# EAGLE design LEDChaserSchematic (EAGLE 9.6.2)
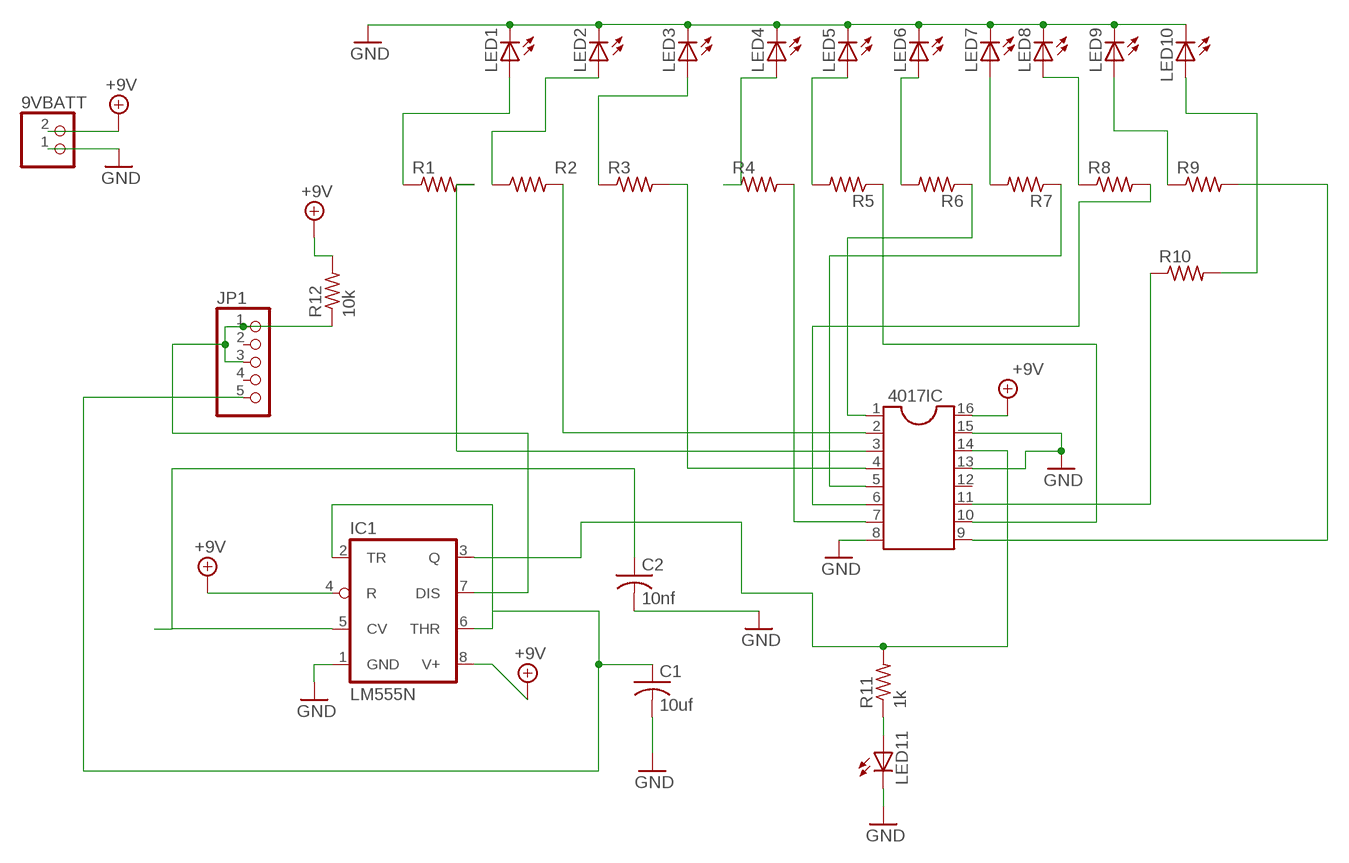
[diagram p0: schematic, sheet 1]

## Parts
9VBATT  JST_2PIN-THM  [JST-PH-2-THM]
4017IC  DIL16  [DIL16]
C1  10uf  C-US025-030X050  [C025-030X050]
C2  10nf  C-US025-030X050  [C025-030X050]
IC1  LM555N  [DIL08-ROUND]
JP1  PINHD-1X5  [1X05]
LED1  LED5MM  [LED5MM]
LED2  LED5MM  [LED5MM]
LED3  LED5MM  [LED5MM]
LED4  LED5MM  [LED5MM]
LED5  LED5MM  [LED5MM]
LED6  LED5MM  [LED5MM]
LED7  LED5MM  [LED5MM]
LED8  LED5MM  [LED5MM]
LED9  LED5MM  [LED5MM]
LED10  LED5MM  [LED5MM]
LED11  LED5MM  [LED5MM]
R1  R-US_0204/5  [0204/5]
R2  R-US_0204/5  [0204/5]
R3  R-US_0204/5  [0204/5]
R4  R-US_0204/5  [0204/5]
R5  R-US_0204/5  [0204/5]
R6  R-US_0204/5  [0204/5]
R7  R-US_0204/5  [0204/5]
R8  R-US_0204/5  [0204/5]
R9  R-US_0204/5  [0204/5]
R10  R-US_0204/5  [0204/5]
R11  1k  R-US_0204/5  [0204/5]
R12  10k  R-US_0204/5  [0204/5]

## Nets
+9V: 9VBATT.2 4017IC.16 IC1.4(R) IC1.8(V+) R12.2
GND: 9VBATT.1 4017IC.8 4017IC.13 4017IC.15 C1.2 C2.2 IC1.1(GND) LED1.K(C) LED2.K(C) LED3.K(C) LED4.K(C) LED5.K(C) LED6.K(C) LED7.K(C) LED8.K(C) LED9.K(C) LED10.K(C) LED11.K(C)
N$1: LED1.A R1.1
N$2: LED2.A R2.1
N$3: LED3.A R3.1
N$4: LED4.A R4.1
N$5: LED5.A R5.2
N$6: LED6.A R6.2
N$7: LED7.A R7.2
N$8: LED8.A R8.1
N$9: LED9.A R9.1
N$10: LED10.A R10.2
N$11: 4017IC.3 R1.2
N$12: 4017IC.2 R2.2
N$13: 4017IC.4 R3.2
N$14: 4017IC.7 R4.2
N$15: 4017IC.10 R5.1
N$16: 4017IC.1 R6.1
N$17: 4017IC.5 R7.1
N$18: 4017IC.6 R8.2
N$19: 4017IC.9 R9.2
N$20: 4017IC.11 R10.1
N$21: C1.1 IC1.2(TR) IC1.6(THR) JP1.5
N$22: C2.1 IC1.5(CV)
N$23: 4017IC.14 IC1.3(Q) R11.2
N$24: LED11.A R11.1
N$25: IC1.7(DIS) JP1.1 JP1.3 R12.1
Unconnected: 4017IC.12 JP1.2 JP1.4

## Library data of the parts
9VBATT = adafruit:JST_2PIN: JST 2-Pin Connectors of various flavors SMT-RA (S2B-PH-SM4) 4UConnector #17311 SMT (B2B-PH-SM4) THM-RA (S2B-PH) THM (B2B-PH)
4017IC = ic-package:DIL16: Dual In Line / Socket
C1 C2 = adafruit:C-US: CAPACITOR, American symbol
IC1 = adafruit:*555: TIMER Changed DIP package to have round (not oval) pin pads http://www.ladyada.net/library/pcb/eaglelibrary.html
JP1 = pinhead:PINHD-1X5: PIN HEADER
LED1-LED11 = adafruit:LED: LED OSRAM: - CHIPLED LG R971, LG N971, LY N971, LG Q971, LY Q971, LO R971, LY R971 LH N974, LH R974 LS Q976, LO Q976, LY Q976 LO Q996 - Hyper CHIPLED LW Q18S LB Q993, LB Q99A, LB R99A - SideLED LS A670, LO A670, LY A670, LG A670, LP A670 LB A673, LV A673, LT A673, LW A673 LH A674 LY A675 LS A676, LA A676, LO A676, LY A676, LW A676 LS A679, LY A679, LG A679 - Hyper Micro SIDELED® LS Y876, LA Y876, LO Y876, LY Y876 LT Y87S - SmartLED LW L88C, LW L88S LB L89C, LB L89S, LG L890 LS L89K, LO L89K, LY L89K LS L896, LA L896, LO L896, LY L896 - TOPLED LS T670, LO T670, LY T670, LG T670, LP T670 LSG T670, LSP T670, LSY T670, LOP T670, LYG T670 LG T671, LOG T671, LSG T671 LB T673, LV T673, LT T673, LW T673 LH T674 LS T676, LA T676, LO T676, LY T676, LB T676, LH T676, LSB T676, LW T676 LB T67C, LV T67C, LT T67C, LS T67K, LO T67K, LY T67K, LW E67C LS E67B, LA E67B, LO E67B, LY E67B, LB E67C, LV E67C, LT E67C LW T67C LS T679, LY T679, LG T679 LS T770, LO T770, LY T770, LG T770, LP T770 LB T773, LV T773, LT T773, LW T773 LH T774 LS E675, LA E675, LY E675, LS T675 LS T776, LA T776, LO T776, LY T776, LB T776 LHGB T686 LT T68C, LB T68C - Hyper Mini TOPLED® LB M676 - Mini TOPLED Santana® LG M470 LS M47K, LO M47K, LY M47K Source: http://www.osram.convergy.de/
R1-R12 = adafruit:R-US_: RESISTOR, American symbol

## Net classes
0 default: clearance 0.205 mm

## Board
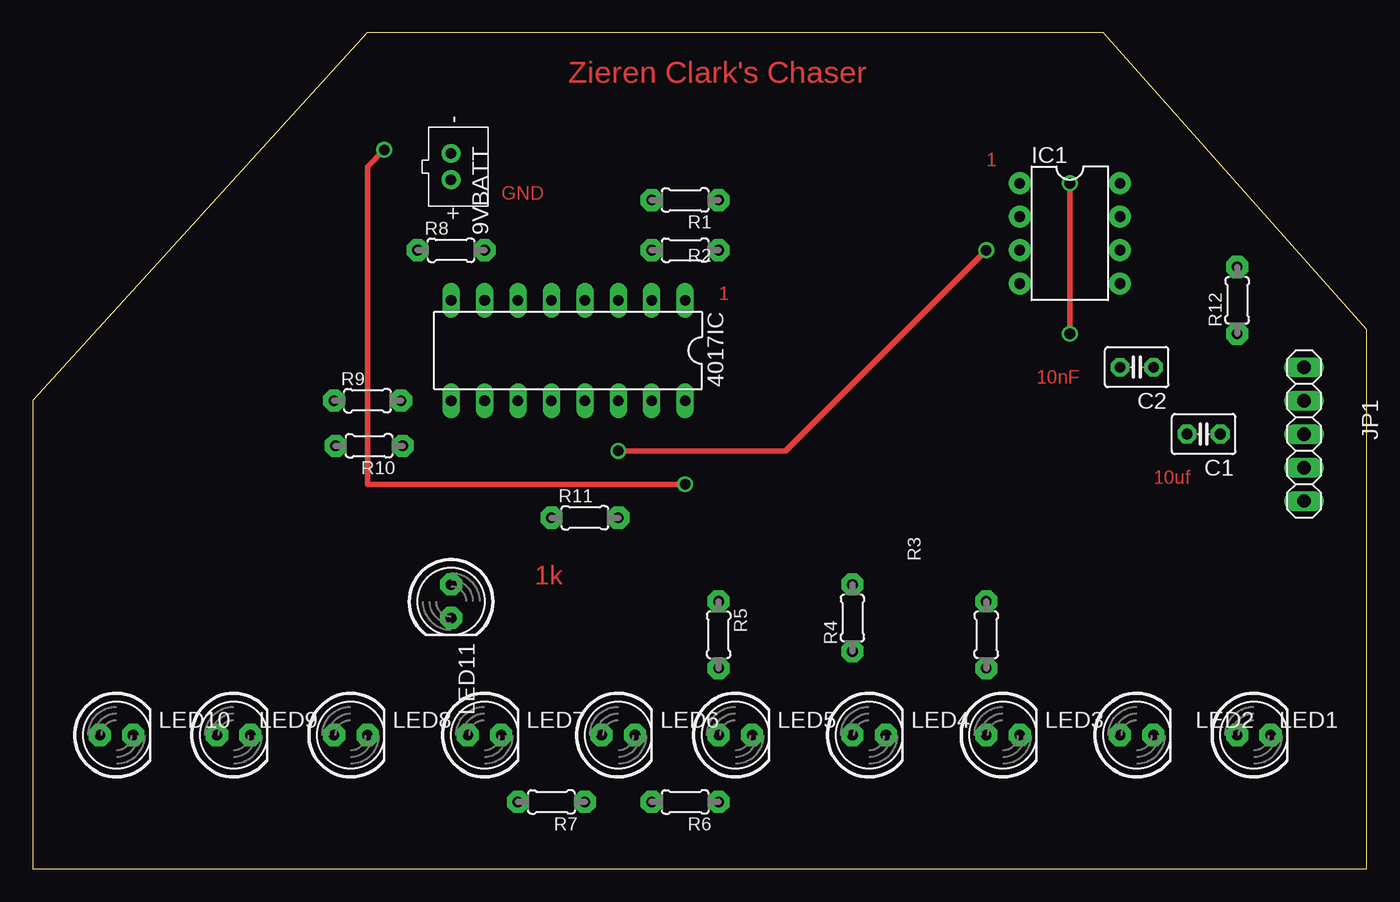
[diagram p1: board, top side]
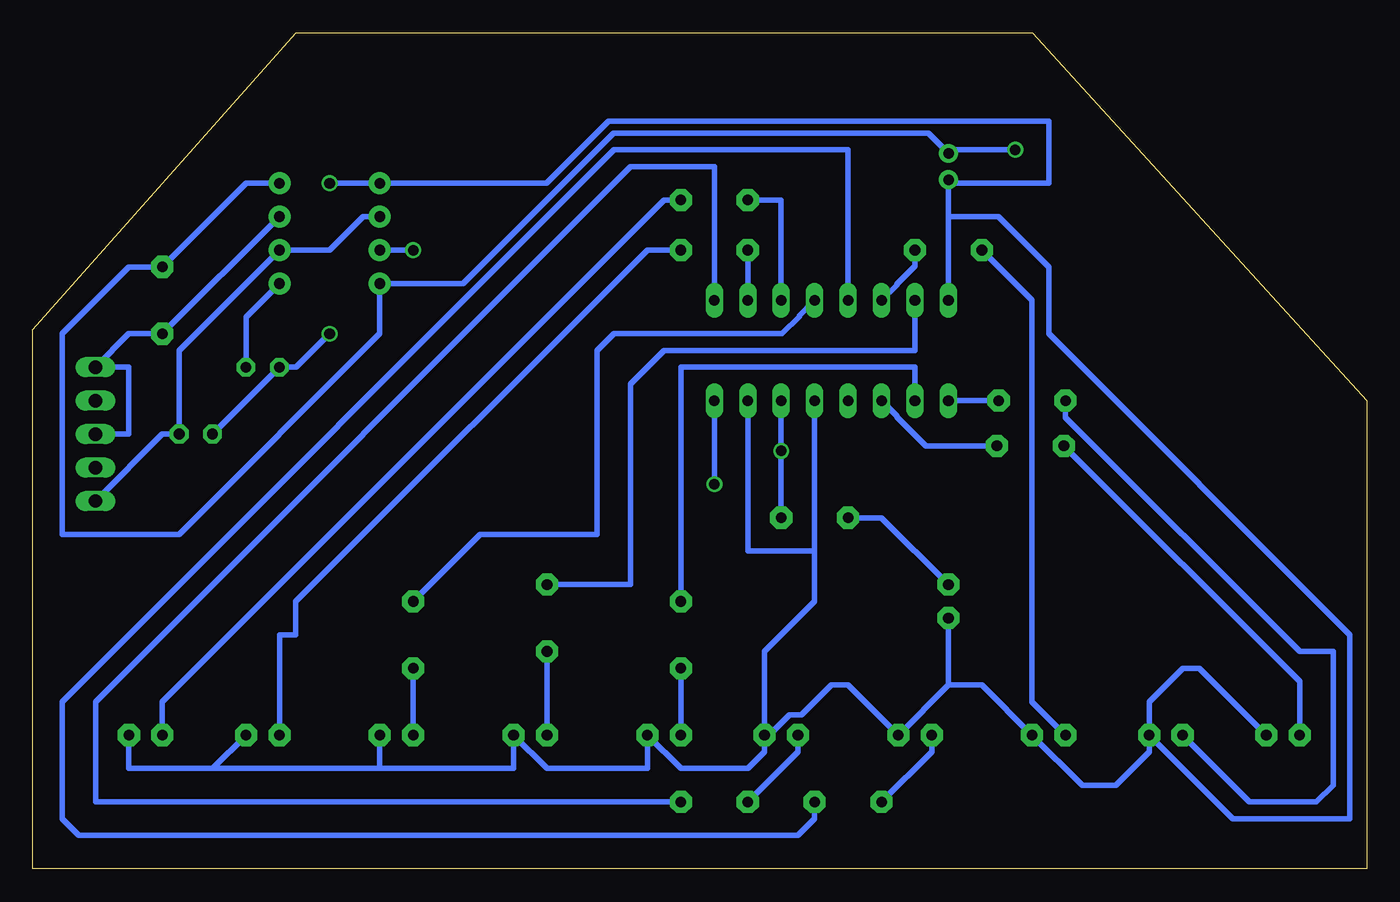
[diagram p2: board, bottom side, seen from below]

Size 101.27 x 63.49 mm. Coordinates in mm from the lower left corner, seen from the top.
Outline: 0,0 101.27,0 101.27,40.97 81.29,63.49 25.39,63.49 0,35.56 0,0
Copper layers (1*16): Top 0.035mm / dielectric 1.5mm / Bottom 0.035mm
Design rules "default *": minimum track width 16mil, minimum drill 0.35mm, track to track 20mil, track to pad 20mil, pad to pad 6mil, via to via 6mil, smd to smd 6mil, copper to edge 40mil, drill to drill 6mil, minimum pad ring 10mil, minimum via ring 8mil, stop-mask expansion 4mil, vias tented up to drill 0mil, thermal gap 10mil

### Footprints (pad centres in the part's own frame; a part is rotated, then mirrored left to right if it is on the bottom)
JST-PH-2-THM = drill 0.8 pad 1.422: 1 1,0; 2 -1,0
DIL16 = drill 0.813 long: 1 -8.89,-3.81; 2 -6.35,-3.81; 3 -3.81,-3.81; 4 -1.27,-3.81; 5 1.27,-3.81; 6 3.81,-3.81; 7 6.35,-3.81; 8 8.89,-3.81; 9 8.89,3.81; 10 6.35,3.81; 11 3.81,3.81; 12 1.27,3.81; 13 -1.27,3.81; 14 -3.81,3.81; 15 -6.35,3.81; 16 -8.89,3.81
C025-030X050 = drill 0.813 pad 1.422 octagon: 1 -1.27,0; 2 1.27,0
DIL08-ROUND = drill 0.813 pad 1.676: 1 -3.81,-3.81; 2 -1.27,-3.81; 3 1.27,-3.81; 4 3.81,-3.81; 5 3.81,3.81; 6 1.27,3.81; 7 -1.27,3.81; 8 -3.81,3.81
1X05 = drill 1.016 long: 1 -5.08,0; 2 -2.54,0; 3 0,0; 4 2.54,0; 5 5.08,0
LED5MM = drill 0.813 pad 1.676 octagon: A -1.27,0; K 1.27,0
0204/5 = drill 0.813 pad 1.676 octagon: 1 -2.54,0; 2 2.54,0

### Placement (x,y rotation side)
9VBATT  31.75,53.34 270 top
4017IC  40.64,39.37 180 top
C1  88.9,33.02 180 top
C2  83.82,38.1 180 top
IC1  78.74,48.26 270 top
JP1  96.52,33.02 270 top
LED1  92.71,10.16 0 top
LED2  83.82,10.16 0 top
LED3  73.66,10.16 0 top
LED4  63.5,10.16 0 top
LED5  53.34,10.16 0 top
LED6  44.45,10.16 0 top
LED7  34.29,10.16 0 top
LED8  24.13,10.16 0 top
LED9  15.24,10.16 0 top
LED10  6.35,10.16 0 top
LED11  31.75,20.32 270 top
R1  49.53,50.8 180 top
R2  49.53,46.99 180 top
R3  72.39,17.78 90 top
R4  62.23,19.05 90 top
R5  52.07,17.78 270 top
R6  49.53,5.08 180 top
R7  39.37,5.08 180 top
R8  31.75,46.99 0 top
R9  25.4,35.56 0 top
R10  25.53,32.13 180 top
R11  41.91,26.67 0 top
R12  91.44,43.18 90 top

### Tracks (layer width: path | path; a pad name or v marks a point on that pad's centre or on a via)
+9V  (via drill 0.8)
  Top 0.406: v49.53,29.21 25.4,29.21 25.4,53.34 v26.67,54.61
  Bottom 0.406: 4017IC.16 v49.53,29.21 | IC1.8 85.09,52.07 R12.2 93.98,45.72 99.06,40.64 99.06,25.4 90.17,25.4 74.93,40.64 IC1.4 68.6,44.45 57.17,55.88 33.29,55.88 9VBATT.2 31.48,54.61 v26.67,54.61
GND  (via drill 0.8)
  Top 0.406: v78.74,52.07 v78.74,40.64
  Bottom 0.406: 4017IC.8 31.75,49.53 | 31.75,49.53 9VBATT.1 31.48,52.07 24.13,52.07 24.13,56.79 57.55,56.79 62.28,52.07 IC1.1 v78.74,52.07 | LED1.K 93.98,7.62 87.63,7.62 | LED2.K 87.63,7.62 | 74.93,7.62 87.63,7.62 | LED3.K 74.93,7.62 | 74.93,7.62 64.77,7.62 LED4.K 62.23,7.62 54.61,7.62 LED5.K 52.07,7.62 46.99,7.62 45.72,8.89 LED6.K | LED6.K 45.37,10.16 43.82,11.71 42.9,11.71 40.64,13.97 39.37,13.97 LED7.K 31.75,13.97 | 31.75,13.97 29.21,13.97 LED8.K 21.59,6.35 19.05,6.35 16.51,8.89 LED9.K | LED10.K 12.7,15.24 13.97,15.24 16.51,12.7 LED9.K | LED9.K 10.16,3.81 1.27,3.81 1.27,17.78 24.13,40.64 24.13,45.72 27.94,49.53 31.75,49.53 | 4017IC.13 41.91,24.13 | 41.91,24.13 46.99,24.13 4017IC.15 | 41.91,24.13 41.91,20.32 45.72,16.51 LED6.K | LED11.K 31.75,13.97 | C1.2 C2.2 81.28,38.1 v78.74,40.64
N$1
  Bottom 0.406: R1.1 53.34,50.8 91.44,12.7 LED1.A
N$2
  Bottom 0.406: LED2.A 82.55,17.78 81.3,17.78 81.3,20.3 54.61,46.99 R2.1
N$3
  Bottom 0.406: R3.1 LED3.A
N$4
  Bottom 0.406: R4.1 LED4.A
N$5
  Bottom 0.406: R5.2 LED5.A
N$6
  Bottom 0.406: R6.2 43.18,8.89 LED6.A
N$7
  Bottom 0.406: LED7.A 33.02,8.89 R7.2
N$8
  Bottom 0.406: R8.1 25.4,43.18 25.4,12.7 LED8.A
N$9
  Bottom 0.406: LED9.A 8.89,5.08 3.81,5.08 2.54,6.35 2.54,16.51 5.08,16.51 22.86,34.29 R9.1
N$10
  Bottom 0.406: R10.2 5.08,14.22 LED10.A
N$11
  Bottom 0.406: 4017IC.3 44.45,50.8 R1.2
N$12
  Bottom 0.406: 4017IC.2 R2.2
N$13
  Bottom 0.406: 4017IC.4 43.08,42.01 43.08,41.95 44.39,40.64 57.15,40.64 58.42,39.37 58.42,25.4 67.31,25.4 R3.2
N$14
  Bottom 0.406: 4017IC.7 34.29,39.37 53.34,39.37 55.88,36.83 55.88,21.59 R4.2
N$15
  Bottom 0.406: 4017IC.10 34.29,38.1 52.07,38.1 R5.1
N$16
  Bottom 0.406: 4017IC.1 49.53,53.34 55.88,53.34 96.52,12.7 96.52,5.08 R6.1
N$17
  Bottom 0.406: 4017IC.5 39.37,54.61 57.15,54.61 99.06,12.7 99.06,3.81 97.79,2.54 43.18,2.54 41.91,3.81 R7.1
N$18
  Bottom 0.406: 4017IC.6 35.66,44.35 35.66,44.41 34.29,45.78 R8.2
N$19
  Bottom 0.406: 4017IC.9 R9.2
N$20
  Bottom 0.406: 4017IC.11 35.66,34.39 35.66,34.33 33.46,32.13 R10.1
N$21
  Bottom 0.406: JP1.5 91.44,33.02 C1.1 90.17,39.37 IC1.6 78.74,46.99 76.2,49.53 IC1.2
N$22
  Bottom 0.406: IC1.5 85.09,41.91 C2.1
N$23  (via drill 0.8)
  Top 0.406: v72.39,46.99 57.15,31.75 v44.45,31.75
  Bottom 0.406: 4017IC.14 v44.45,31.75 R11.2 | IC1.3 v72.39,46.99
N$24
  Bottom 0.406: R11.1 36.83,26.67 LED11.A
N$25
  Bottom 0.406: IC1.7 R12.1 93.98,40.64 JP1.1 93.98,38.1 93.98,33.02 JP1.3

### Text on the board
Top: Zieren Clark's Chaser | 1 | GND | 1 | 10nF | 10uf | 1k